# Altium schematic sheet [03] - CONNECTORS.SchDoc
size A3; DocumentNumber: 2; SheetNumber: 3; SheetTotal: 19
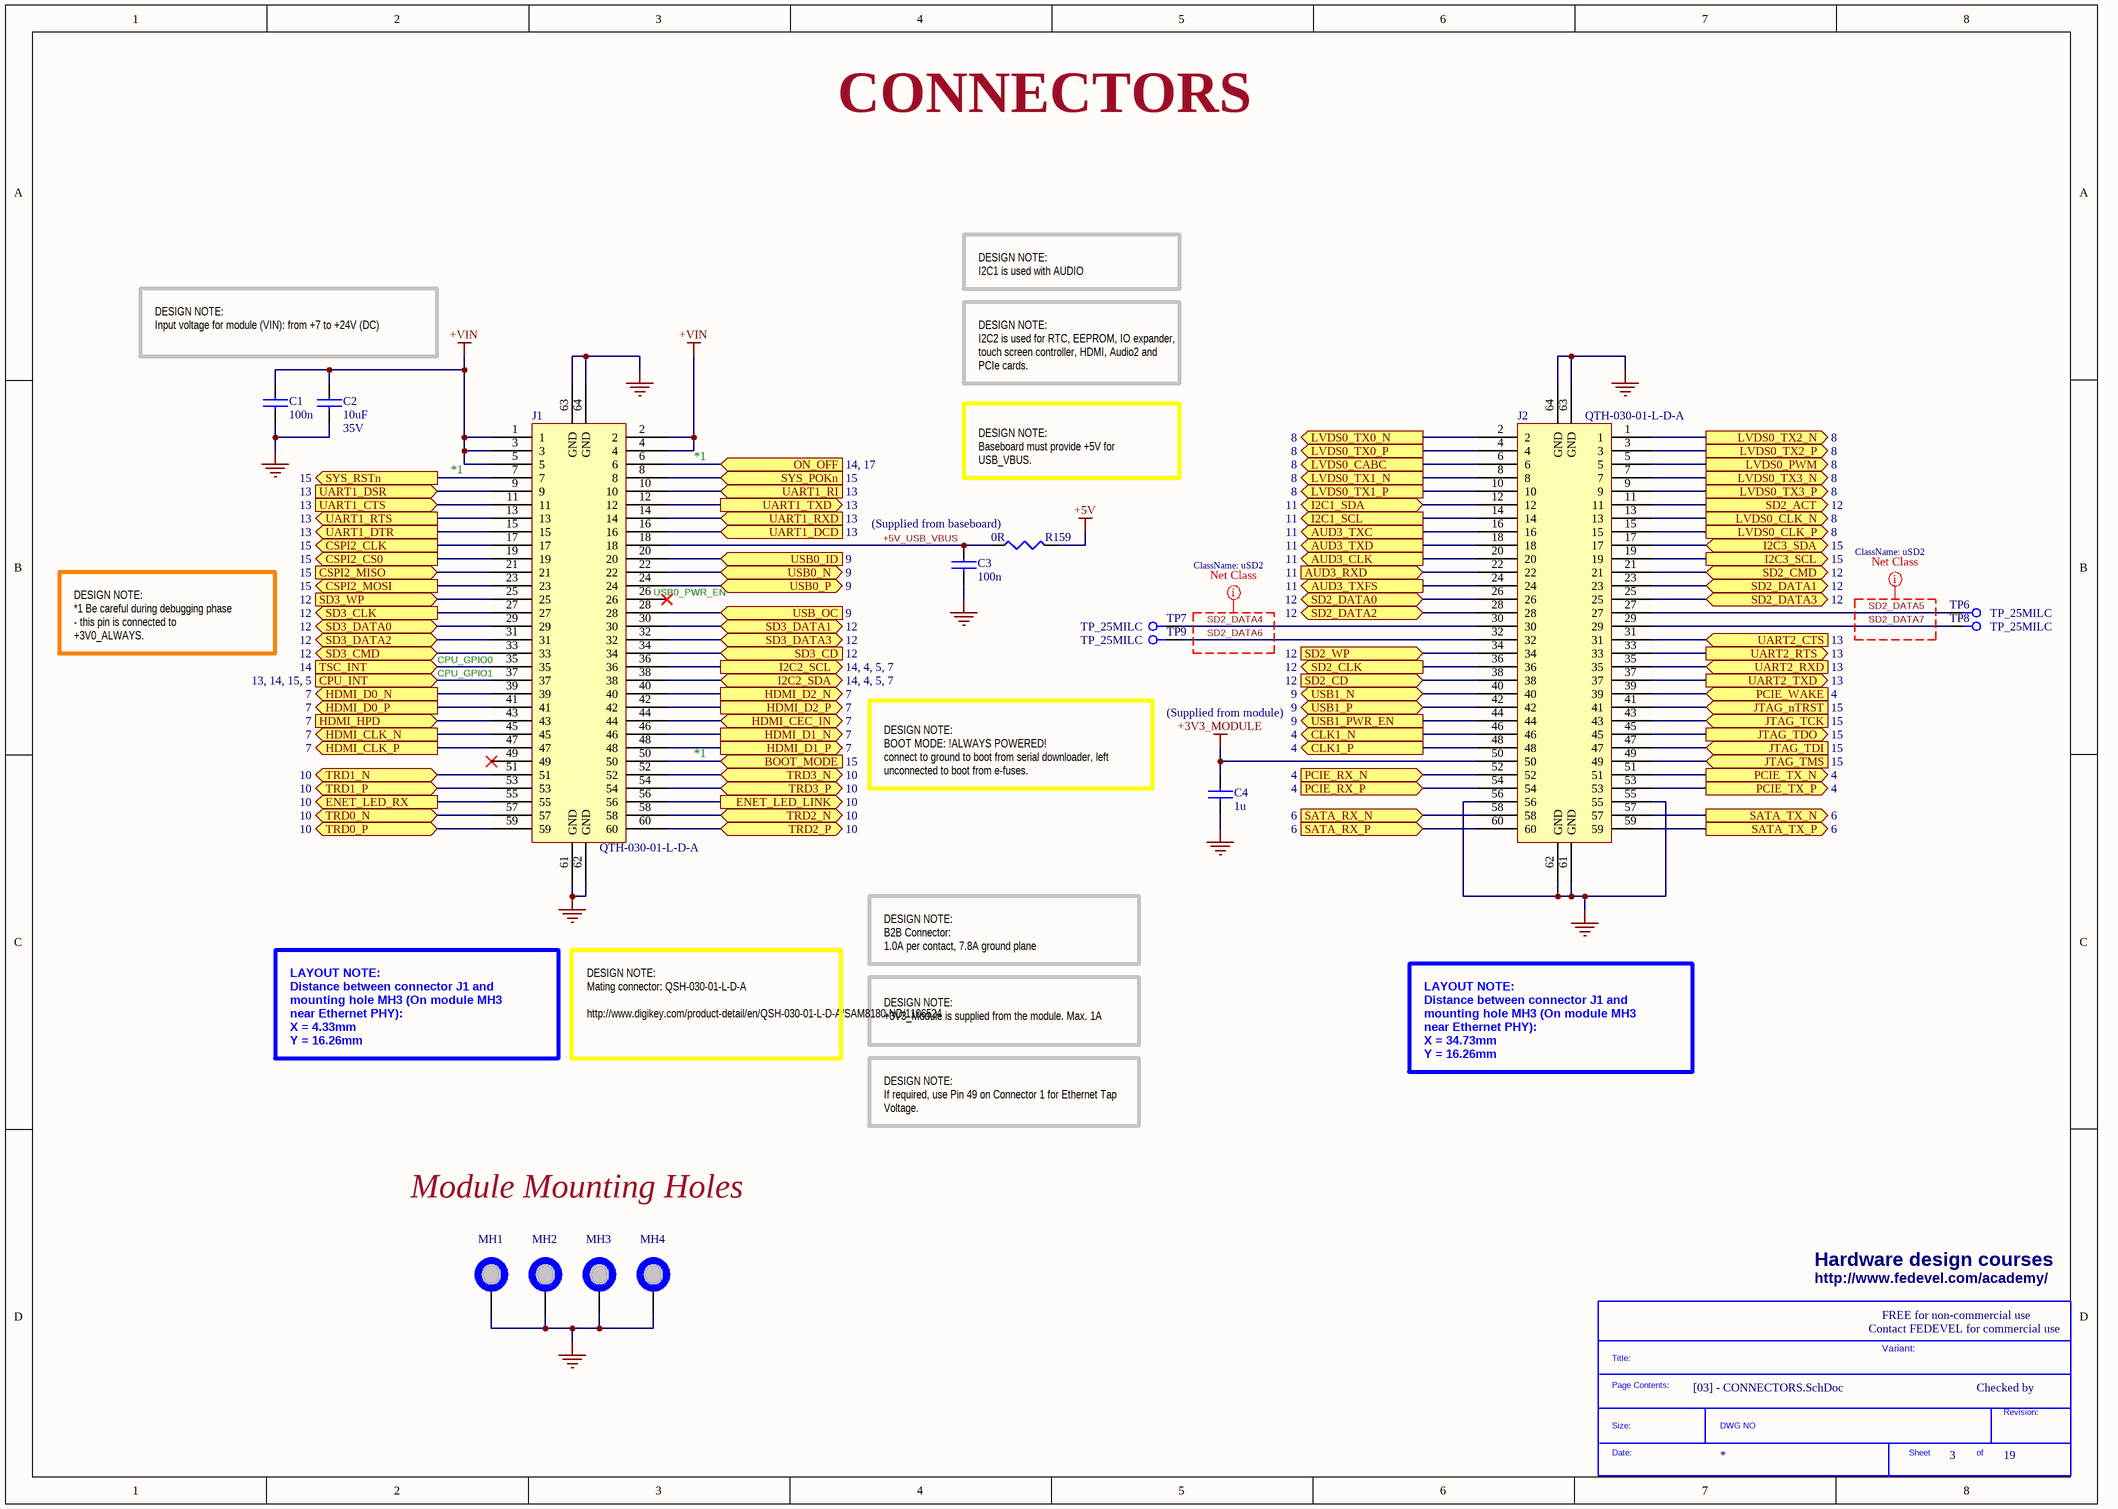
[diagram p0: [03] - CONNECTORS.SchDoc]

## Parts
*  SDTitleBlock  (value not drawn)  (graphical)
C1  100n  [C0402]
C2  10uF  Voltage - Rated: 35V  [C1206]
C3  100n  [C0402]
C4  1u  [C0402]
J1  QTH-030-01-L-D-A  [QTH-030-01-L-D-A]
J2  QTH-030-01-L-D-A  [QTH-030-01-L-D-A]
MH1  MH_5MMC_2.2MMD  [MH_5MMD_2.2MMD]  (value not drawn)  (no BOM)
MH2  MH_5MMC_2.2MMD  [MH_5MMD_2.2MMD]  (value not drawn)  (no BOM)
MH3  MH_5MMC_2.2MMD  [MH_5MMD_2.2MMD]  (value not drawn)  (no BOM)
MH4  MH_5MMC_2.2MMD  [MH_5MMD_2.2MMD]  (value not drawn)  (no BOM)
R159  0R  [R0402]
TP6  TP_25MILC  [TP_25C]  (no BOM)
TP7  TP_25MILC  [TP_25C]  (no BOM)
TP8  TP_25MILC  [TP_25C]  (no BOM)
TP9  TP_25MILC  [TP_25C]  (no BOM)

## Ports
AUD3_CLK (out, see 11), AUD3_RXD (in, see 11), AUD3_TXC (out, see 11), AUD3_TXD (out, see 11), AUD3_TXFS (out, see 11), BOOT_MODE (in, see 15), CLK1_N (out, see 4), CLK1_P (out, see 4), CPU_INT (in, see 13, 14, 15, 5), CSPI2_CLK (out, see 15), CSPI2_CS0 (out, see 15), CSPI2_MISO (in, see 15), CSPI2_MOSI (out, see 15), ENET_LED_LINK (out, see 10), ENET_LED_RX (out, see 10), HDMI_CEC_IN (bidir, see 7), HDMI_CLK_N (out, see 7), HDMI_CLK_P (out, see 7), HDMI_D0_N (out, see 7), HDMI_D0_P (out, see 7), HDMI_D1_N (out, see 7), HDMI_D1_P (out, see 7), HDMI_D2_N (out, see 7), HDMI_D2_P (out, see 7), HDMI_HPD (in, see 7), I2C1_SCL (out, see 11), I2C1_SDA (bidir, see 11), I2C2_SCL (see 14, 4, 5, 7), I2C2_SDA (bidir, see 14, 4, 5, 7), I2C3_SCL (out, see 15), I2C3_SDA (bidir, see 15), JTAG_nTRST (in, see 15), JTAG_TCK (in, see 15), JTAG_TDI (in, see 15), JTAG_TDO (out, see 15), JTAG_TMS (in, see 15), LVDS0_CABC (out, see 8), LVDS0_CLK_N (out, see 8), LVDS0_CLK_P (out, see 8), LVDS0_PWM (out, see 8), LVDS0_TX0_N (out, see 8), LVDS0_TX0_P (out, see 8), LVDS0_TX1_N (out, see 8), LVDS0_TX1_P (out, see 8), LVDS0_TX2_N (out, see 8), LVDS0_TX2_P (out, see 8), LVDS0_TX3_N (out, see 8), LVDS0_TX3_P (out, see 8), ON_OFF (in, see 14, 17), PCIE_RX_N (in, see 4), PCIE_RX_P (in, see 4), PCIE_TX_N (out, see 4), PCIE_TX_P (out, see 4), PCIE_WAKE (in, see 4), SATA_RX_N (in, see 6), SATA_RX_P (in, see 6), SATA_TX_N (out, see 6), SATA_TX_P (out, see 6), SD2_ACT (out, see 12), SD2_CD (in, see 12), SD2_CLK (out, see 12), SD2_CMD (bidir, see 12), SD2_DATA0 (bidir, see 12), SD2_DATA1 (bidir, see 12), SD2_DATA2 (bidir, see 12), SD2_DATA3 (bidir, see 12), SD2_WP (in, see 12), SD3_CD (in, see 12), SD3_CLK (out, see 12), SD3_CMD (bidir, see 12), SD3_DATA0 (bidir, see 12), SD3_DATA1 (bidir, see 12), SD3_DATA2 (bidir, see 12), SD3_DATA3 (bidir, see 12), SD3_WP (in, see 12), SYS_POKn (in, see 15), SYS_RSTn (out, see 15), TRD0_N (bidir, see 10), TRD0_P (bidir, see 10), TRD1_N (bidir, see 10), TRD1_P (bidir, see 10), TRD2_N (bidir, see 10), TRD2_P (bidir, see 10), TRD3_N (bidir, see 10), TRD3_P (bidir, see 10), TSC_INT (in, see 14), UART1_CTS (in, see 13), UART1_DCD (in, see 13), UART1_DSR (in, see 13), UART1_DTR (out, see 13), UART1_RI (in, see 13), UART1_RTS (out, see 13), UART1_RXD (in, see 13), UART1_TXD (out, see 13), UART2_CTS (in, see 13), UART2_RTS (out, see 13), UART2_RXD (in, see 13), UART2_TXD (out, see 13), USB0_ID (in, see 9), USB0_N (bidir, see 9), USB0_P (bidir, see 9), USB1_N (bidir, see 9), USB1_P (bidir, see 9), USB1_PWR_EN (out, see 9), USB_OC (in, see 9)

## Nets
+3V3_MODULE: C4.1 J2.50
+5V: R159.2
+VIN: C1.1 C2.1 J1.1 J1.2 J1.3 J1.4 J1.5
GND: C1.2 C2.2 C3.2 C4.2 J1.61(GND) J1.62(GND) J1.63(GND) J1.64(GND) J2.55 J2.56 J2.61(GND) J2.62(GND) J2.63(GND) J2.64(GND) MH1.1 MH2.1 MH3.1 MH4.1
+5V_USB_VBUS: C3.1 J1.18 R159.1
AUD3_CLK: J2.20 ; port AUD3_CLK
AUD3_RXD: J2.22 ; port AUD3_RXD
AUD3_TXC: J2.16 ; port AUD3_TXC
AUD3_TXD: J2.18 ; port AUD3_TXD
AUD3_TXFS: J2.24 ; port AUD3_TXFS
BOOT_MODE: J1.50 ; port BOOT_MODE
CLK1_N: J2.46 ; port CLK1_N
CLK1_P: J2.48 ; port CLK1_P
CPU_INT: J1.37 ; port CPU_INT
CSPI2_CLK: J1.17 ; port CSPI2_CLK
CSPI2_CS0: J1.19 ; port CSPI2_CS0
CSPI2_MISO: J1.21 ; port CSPI2_MISO
CSPI2_MOSI: J1.23 ; port CSPI2_MOSI
ENET_LED_LINK: J1.56 ; port ENET_LED_LINK
ENET_LED_RX: J1.55 ; port ENET_LED_RX
HDMI_CEC_IN: J1.44 ; port HDMI_CEC_IN
HDMI_CLK_N: J1.45 ; port HDMI_CLK_N
HDMI_CLK_P: J1.47 ; port HDMI_CLK_P
HDMI_D0_N: J1.39 ; port HDMI_D0_N
HDMI_D0_P: J1.41 ; port HDMI_D0_P
HDMI_D1_N: J1.46 ; port HDMI_D1_N
HDMI_D1_P: J1.48 ; port HDMI_D1_P
HDMI_D2_N: J1.40 ; port HDMI_D2_N
HDMI_D2_P: J1.42 ; port HDMI_D2_P
HDMI_HPD: J1.43 ; port HDMI_HPD
I2C1_SCL: J2.14 ; port I2C1_SCL
I2C1_SDA: J2.12 ; port I2C1_SDA
I2C2_SCL: J1.36 ; port I2C2_SCL
I2C2_SDA: J1.38 ; port I2C2_SDA
I2C3_SCL: J2.19 ; port I2C3_SCL
I2C3_SDA: J2.17 ; port I2C3_SDA
JTAG_nTRST: J2.41 ; port JTAG_nTRST
JTAG_TCK: J2.43 ; port JTAG_TCK
JTAG_TDI: J2.47 ; port JTAG_TDI
JTAG_TDO: J2.45 ; port JTAG_TDO
JTAG_TMS: J2.49 ; port JTAG_TMS
LVDS0_CABC: J2.6 ; port LVDS0_CABC
LVDS0_CLK_N: J2.13 ; port LVDS0_CLK_N
LVDS0_CLK_P: J2.15 ; port LVDS0_CLK_P
LVDS0_PWM: J2.5 ; port LVDS0_PWM
LVDS0_TX0_N: J2.2 ; port LVDS0_TX0_N
LVDS0_TX0_P: J2.4 ; port LVDS0_TX0_P
LVDS0_TX1_N: J2.8 ; port LVDS0_TX1_N
LVDS0_TX1_P: J2.10 ; port LVDS0_TX1_P
LVDS0_TX2_N: J2.1 ; port LVDS0_TX2_N
LVDS0_TX2_P: J2.3 ; port LVDS0_TX2_P
LVDS0_TX3_N: J2.7 ; port LVDS0_TX3_N
LVDS0_TX3_P: J2.9 ; port LVDS0_TX3_P
ON_OFF: J1.6 ; port ON_OFF
PCIE_RX_N: J2.52 ; port PCIE_RX_N
PCIE_RX_P: J2.54 ; port PCIE_RX_P
PCIE_TX_N: J2.51 ; port PCIE_TX_N
PCIE_TX_P: J2.53 ; port PCIE_TX_P
PCIE_WAKE: J2.39 ; port PCIE_WAKE
SATA_RX_N: J2.58 ; port SATA_RX_N
SATA_RX_P: J2.60 ; port SATA_RX_P
SATA_TX_N: J2.57 ; port SATA_TX_N
SATA_TX_P: J2.59 ; port SATA_TX_P
SD2_ACT: J2.11 ; port SD2_ACT
SD2_CD: J2.38 ; port SD2_CD
SD2_CLK: J2.36 ; port SD2_CLK
SD2_CMD: J2.21 ; port SD2_CMD
SD2_DATA0: J2.26 ; port SD2_DATA0
SD2_DATA1: J2.23 ; port SD2_DATA1
SD2_DATA2: J2.28 ; port SD2_DATA2
SD2_DATA3: J2.25 ; port SD2_DATA3
SD2_DATA4: J2.30 TP7.1
SD2_DATA5: J2.27 TP6.1
SD2_DATA6: J2.32 TP9.1
SD2_DATA7: J2.29 TP8.1
SD2_WP: J2.34 ; port SD2_WP
SD3_CD: J1.34 ; port SD3_CD
SD3_CLK: J1.27 ; port SD3_CLK
SD3_CMD: J1.33 ; port SD3_CMD
SD3_DATA0: J1.29 ; port SD3_DATA0
SD3_DATA1: J1.30 ; port SD3_DATA1
SD3_DATA2: J1.31 ; port SD3_DATA2
SD3_DATA3: J1.32 ; port SD3_DATA3
SD3_WP: J1.25 ; port SD3_WP
SYS_POKn: J1.8 ; port SYS_POKn
SYS_RSTn: J1.7 ; port SYS_RSTn
TRD0_N: J1.57 ; port TRD0_N
TRD0_P: J1.59 ; port TRD0_P
TRD1_N: J1.51 ; port TRD1_N
TRD1_P: J1.53 ; port TRD1_P
TRD2_N: J1.58 ; port TRD2_N
TRD2_P: J1.60 ; port TRD2_P
TRD3_N: J1.52 ; port TRD3_N
TRD3_P: J1.54 ; port TRD3_P
TSC_INT: J1.35 ; port TSC_INT
UART1_CTS: J1.11 ; port UART1_CTS
UART1_DCD: J1.16 ; port UART1_DCD
UART1_DSR: J1.9 ; port UART1_DSR
UART1_DTR: J1.15 ; port UART1_DTR
UART1_RI: J1.10 ; port UART1_RI
UART1_RTS: J1.13 ; port UART1_RTS
UART1_RXD: J1.14 ; port UART1_RXD
UART1_TXD: J1.12 ; port UART1_TXD
UART2_CTS: J2.31 ; port UART2_CTS
UART2_RTS: J2.33 ; port UART2_RTS
UART2_RXD: J2.35 ; port UART2_RXD
UART2_TXD: J2.37 ; port UART2_TXD
USB0_ID: J1.20 ; port USB0_ID
USB0_N: J1.22 ; port USB0_N
USB0_P: J1.24 ; port USB0_P
USB1_N: J2.40 ; port USB1_N
USB1_P: J2.42 ; port USB1_P
USB1_PWR_EN: J2.44 ; port USB1_PWR_EN
USB_OC: J1.28 ; port USB_OC

Not connected (* = marked no-connect by the designer): J1 26* 49* 65(HOLE1) 66(HOLE2); J2 65(HOLE1) 66(HOLE2)

## Layout directives
net class uSD2: SD2_DATA4, SD2_DATA5, SD2_DATA6, SD2_DATA7

## Notes on the sheet
- CONNECTORS
- DESIGN NOTE:
  I2C1 is used with AUDIO
- DESIGN NOTE:
  Input voltage for module (VIN): from +7 to +24V (DC)
- DESIGN NOTE:
  I2C2 is used for RTC, EEPROM, IO expander, touch screen controller, HDMI, Audio2 and PCIe cards.
- *1
- DESIGN NOTE:
  Baseboard must provide +5V for USB_VBUS.
- (near R159) (Supplied from baseboard)
- DESIGN NOTE:
  *1 Be careful during debugging phase - this pin is connected to +3V0_ALWAYS.
- (near J1) USB0_PWR_EN
- (near J1) CPU_GPIO0
- (near J1) CPU_GPIO1
- (Supplied from module)
- DESIGN NOTE:
  BOOT MODE: !ALWAYS POWERED!
  connect to ground to boot from serial downloader, left unconnected to boot from e-fuses.
- DESIGN NOTE:
  B2B Connector:
  1.0A per contact, 7.8A ground plane
- LAYOUT NOTE:
  Distance between connector J1 and mounting hole MH3 (On module MH3 near Ethernet PHY):
  X = 4.33mm
  Y = 16.26mm
- DESIGN NOTE:
  Mating connector: QSH-030-01-L-D-A
  http://www.digikey.com/product-detail/en/QSH-030-01-L-D-A/SAM8180-ND/1106524
- DESIGN NOTE:
  +3V3_Module is supplied from the module. Max. 1A
- LAYOUT NOTE:
  Distance between connector J1 and mounting hole MH3 (On module MH3 near Ethernet PHY):
  X = 34.73mm
  Y = 16.26mm
- DESIGN NOTE:
  If required, use Pin 49 on Connector 1 for Ethernet Tap Voltage.
- Module Mounting Holes
- Hardware design courses
- http://www.fedevel.com/academy/
- Contact FEDEVEL for commercial use
- FREE for non-commercial use
- Variant:
- Checked by
- (in symbol SDTitleBlock) Title:; Page Contents:; Revision:; Size:; DWG NO; Date:; Sheet; of

## Library data of the parts
C1 C3 = C1005X5R1H104K: CAP CER .10UF 50V X5R 10% 0402; Manufacturer: TDK Corporation; Capacitance: 0.1µF; Value: 100nF; .Checked PCB: used; Description: CAP CER 0.1UF 50V 10% X5R 0402; Category: Capacitors; Supplier Part Number: 445-5942-1-ND; Manufacturer Part Number: C1005X5R1H104K; Operating Temperature: -55°C ~ 85°C; Package / Case: 0402 (1005 Metric); Price 1k [$]: 0.02340; .Checked SCH: used; Voltage - Rated: 50V; Supplier: Digikey; Supplier 1: Digi-Key; Supplier Part Number 1: 445-5942-1-ND; RoHS: RoHS Compliant; Stock 1: 106926; Pricing 1: 1=0.27, 10=0.18, 100=0.072, 250=0.05176, 500=0.0369, 1000=0.027 (USD); Tolerance: ±10%; Temperature Coefficient: X5R; Mounting Type: Surface Mount, MLCC; Applications: General Purpose; Ratings: -; Size / Dimension: 0.039" L x 0.020" W (1.00mm x 0.50mm); Height - Seated (Max): -; Thickness (Max): 0.022" (0.55mm); Lead Spacing: -; Features: -; Packaging: Cut Tape (CT); Lead Style: -; ComponentLink1URL: http://www.tdk.co.jp/tefe02/e412_c.pdf; ComponentLink1Description: http://www.tdk.co.jp/tefe02/e412_c.pdf
C2 = GRM31CR6YA106KA12L: CAP CER 10UF 35V X5R 1206; Manufacturer: Murata Electronics North America; Capacitance: 10µF; .Checked PCB: used; Description: CAP CER 10UF 35V 10% X5R 1206; Tolerance: ±10%; Category: Capacitors; Manufacturer Part Number: GRM31CR6YA106KA12L; Operating Temperature: -55°C ~ 85°C; Package / Case: 1206 (3216 Metric); Price 1k [$]: 0.19448; Value: 10uF; .Checked SCH: used; Supplier Part Number: 490-5524-1-ND; Supplier: Digikey; Supplier 1: Digi-Key; Supplier Part Number 1: 490-5524-1-ND; RoHS: RoHS Compliant; Stock 1: 76334; Pricing 1: 1=0.6, 10=0.501, 50=0.359, 100=0.3142, 250=0.24684, 500=0.2244, 1000=0.17952 (USD); Temperature Coefficient: X5R; Mounting Type: Surface Mount, MLCC; Applications: General Purpose; Ratings: -; Size / Dimension: 0.126" L x 0.063" W (3.20mm x 1.60mm); Height - Seated (Max): -; Thickness (Max): 0.071" (1.80mm); Lead Spacing: -; Features: -; Packaging: Cut Tape (CT); Lead Style: -; ComponentLink1URL: http://www.murata.com/products/catalog/pdf/c02e.pdf; ComponentLink1Description: http://www.murata.com/products/catalog/pdf/c02e.pdf
C4 = C1005X5R1C105K: CAP CER 1.0UF 16V X5R 0402; Manufacturer: TDK Corporation; Capacitance: 1.0µF; Value: 1uF; .Checked PCB: used; Description: CAP CER 1UF 16V 10% X5R 0402; Tolerance: ±10%; Category: Capacitors; Manufacturer Part Number: C1005X5R1C105K; Operating Temperature: -55°C ~ 85°C; Package / Case: 0402 (1005 Metric); Price 1k [$]: 0.02080; .Checked SCH: used; Voltage - Rated: 16V; Supplier Part Number: 445-4978-1-ND; Supplier: Digikey; Supplier 1: Digi-Key; Supplier Part Number 1: 445-4978-1-ND; RoHS: RoHS Compliant; Stock 1: 341010; Pricing 1: 1=0.24, 10=0.16, 100=0.064, 250=0.046, 500=0.0328, 1000=0.024 (USD); Temperature Coefficient: X5R; Mounting Type: Surface Mount, MLCC; Applications: General Purpose; Ratings: -; Size / Dimension: 0.039" L x 0.020" W (1.00mm x 0.50mm); Height - Seated (Max): -; Thickness (Max): 0.022" (0.55mm); Lead Spacing: -; Features: -; Packaging: Cut Tape (CT); Lead Style: -; ComponentLink1URL: http://www.tdk.co.jp/tefe02/e412_c.pdf; ComponentLink1Description: http://www.tdk.co.jp/tefe02/e412_c.pdf
J1 J2 = QTH-030-01-L-D-A: CONN HEADER HS .5MM 60POS DL AU; Manufacturer: Samtec Inc; .Checked PCB: used; Connector Type: Header, Outer Shroud Contacts; Number of Positions: 60; Pitch: 0.020" (0.50mm); Mating connector: QSH-030-01-L-D-A; Mated Stacking Heights: 5mm; .Checked SCH: used; Category: Connectors, Interconnects; Supplier Part Number: SAM8185-ND; Manufacturer Part Number: QTH-030-01-L-D-A; Price 1k [$]: 5.65775; Value: QTH-030-01-L-D-A; Number of Rows: 2; Height with mainting: 5mm; Supplier: Digikey; Supplier 1: Digi-Key; Supplier Part Number 1: SAM8185-ND; RoHS: RoHS Compliant; Stock 1: 4926; Pricing 1: 1=9.14, 10=8.455, 25=7.9976, 50=7.5862, 100=7.0835, 250=6.16952, 500=5.941, 1000=5.7125, 2500=5.484 (USD); Mounting Type: Surface Mount; Features: Board Guide, Ground Bus (Plane); Contact Finish: Gold; Contact Finish Thickness: 10µin (0.25µm); Packaging: Tray; Height Above Board: 0.168" (4.27mm); ComponentLink1URL: http://www.samtec.com/ftppub/cpdf/QTH-XXX-XX-X-D-XXX-MKT.pdf; ComponentLink1Description: http://www.samtec.com/ftppub/cpdf/QTH-XXX-XX-X-D-XXX-MKT.pdf
MH1-MH4 = MH_5MMC_2.2MMD: Mounting Hole 5mm Diameter, 2.2mm Drill
R159 = RC0402JR-070RL: RES 0.0 OHM 1/16W 0402 SMD; Manufacturer: Yageo; Resistance (Ohms): 0.0; Power (Watts): 0.063W, 1/16W; Tolerance: Jumper; .Checked PCB: used; Category: Resistors; Supplier Part Number: 311-0.0JRCT-ND; Manufacturer Part Number: RC0402JR-070RL; Package / Case: 0402 (1005 Metric); Price 1k [$]: 0.01389; Value: 0R; .Checked SCH: used; Supplier: Digikey; Supplier 1: Digi-Key; Supplier Part Number 1: 311-0.0JRCT-ND; RoHS: RoHS Compliant; Stock 1: 1106330; Pricing 1: 10=0.012, 50=0.009, 100=0.0069, 250=0.00512, 500=0.0038, 1000=0.00253 (USD); Composition: Thick Film; Features: -; Temperature Coefficient: -; Size / Dimension: 0.039" L x 0.020" W (1.00mm x 0.50mm); Height: 0.016" (0.40mm); Number of Terminations: 2; Packaging: Cut Tape (CT); ComponentLink1URL: http://www.yageo.com/documents/recent/PYu-RC0402_51_RoHS_L_6.pdf; ComponentLink1Description: http://www.yageo.com/documents/recent/PYu-RC0402_51_RoHS_L_6.pdf
TP6-TP9 = TP_25MILC: Test Point 25mil